# Altium schematic sheet 3 phase NPC inverter.SchDoc
size A2; SheetNumber: 1; SheetTotal: 4
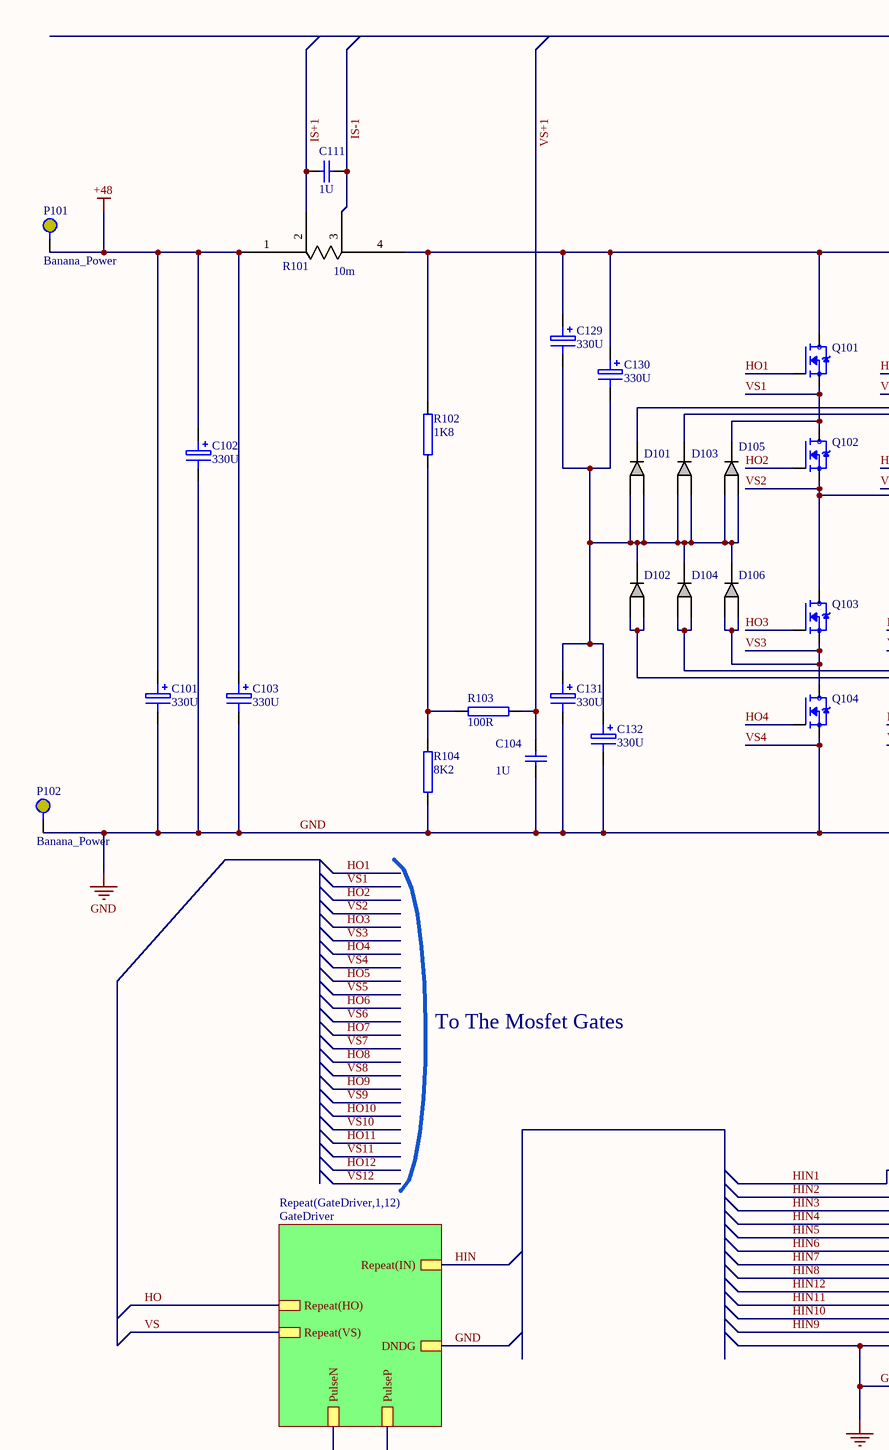
[diagram p0: 3 phase NPC inverter.SchDoc, top left]
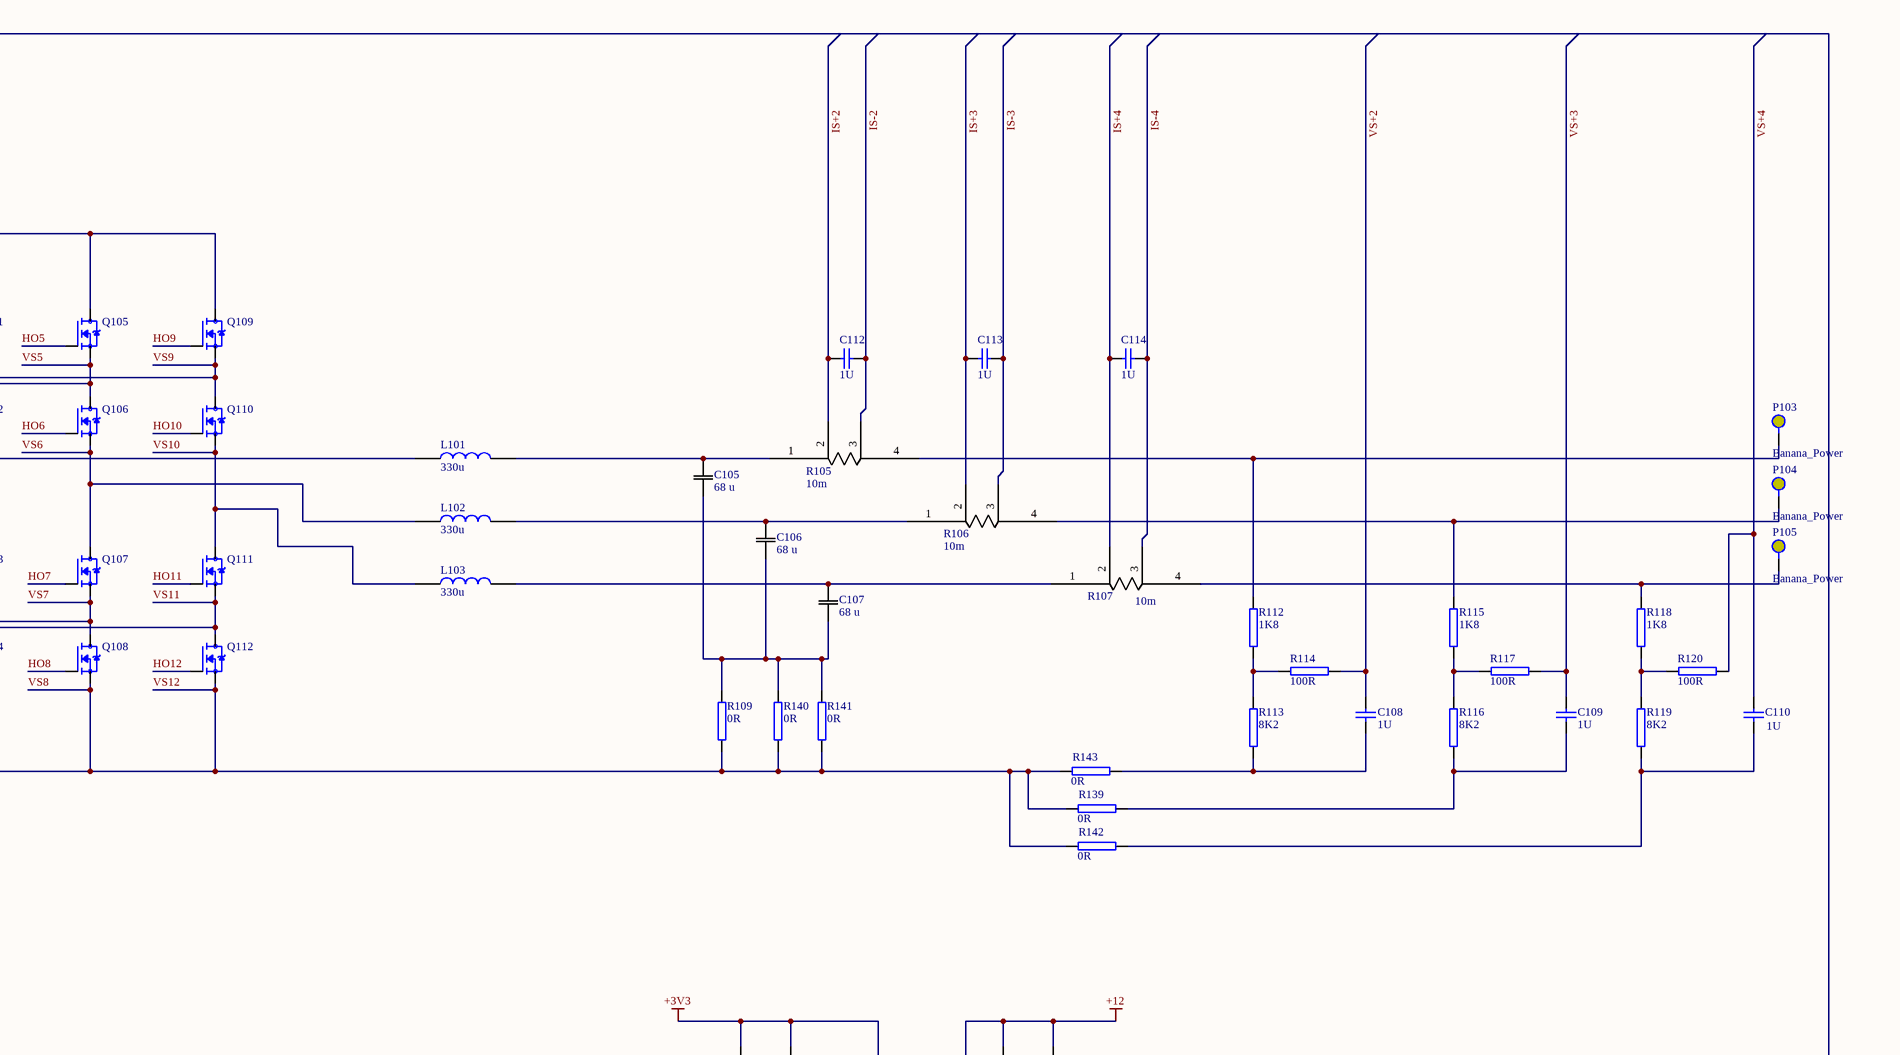
[diagram p1: 3 phase NPC inverter.SchDoc, top right]
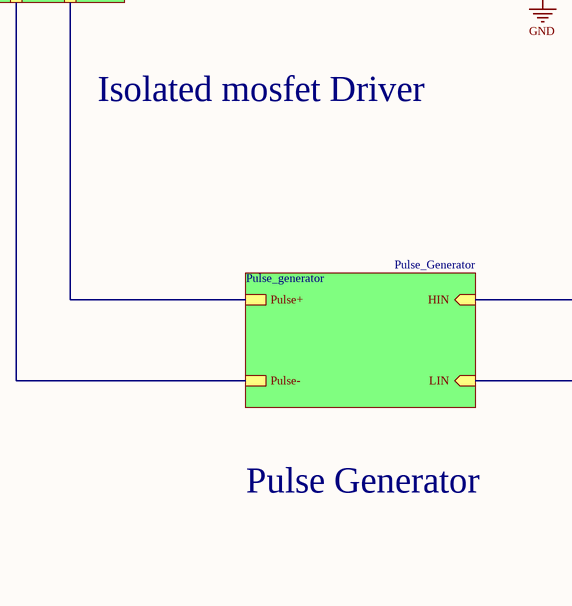
[diagram p2: 3 phase NPC inverter.SchDoc, bottom left]
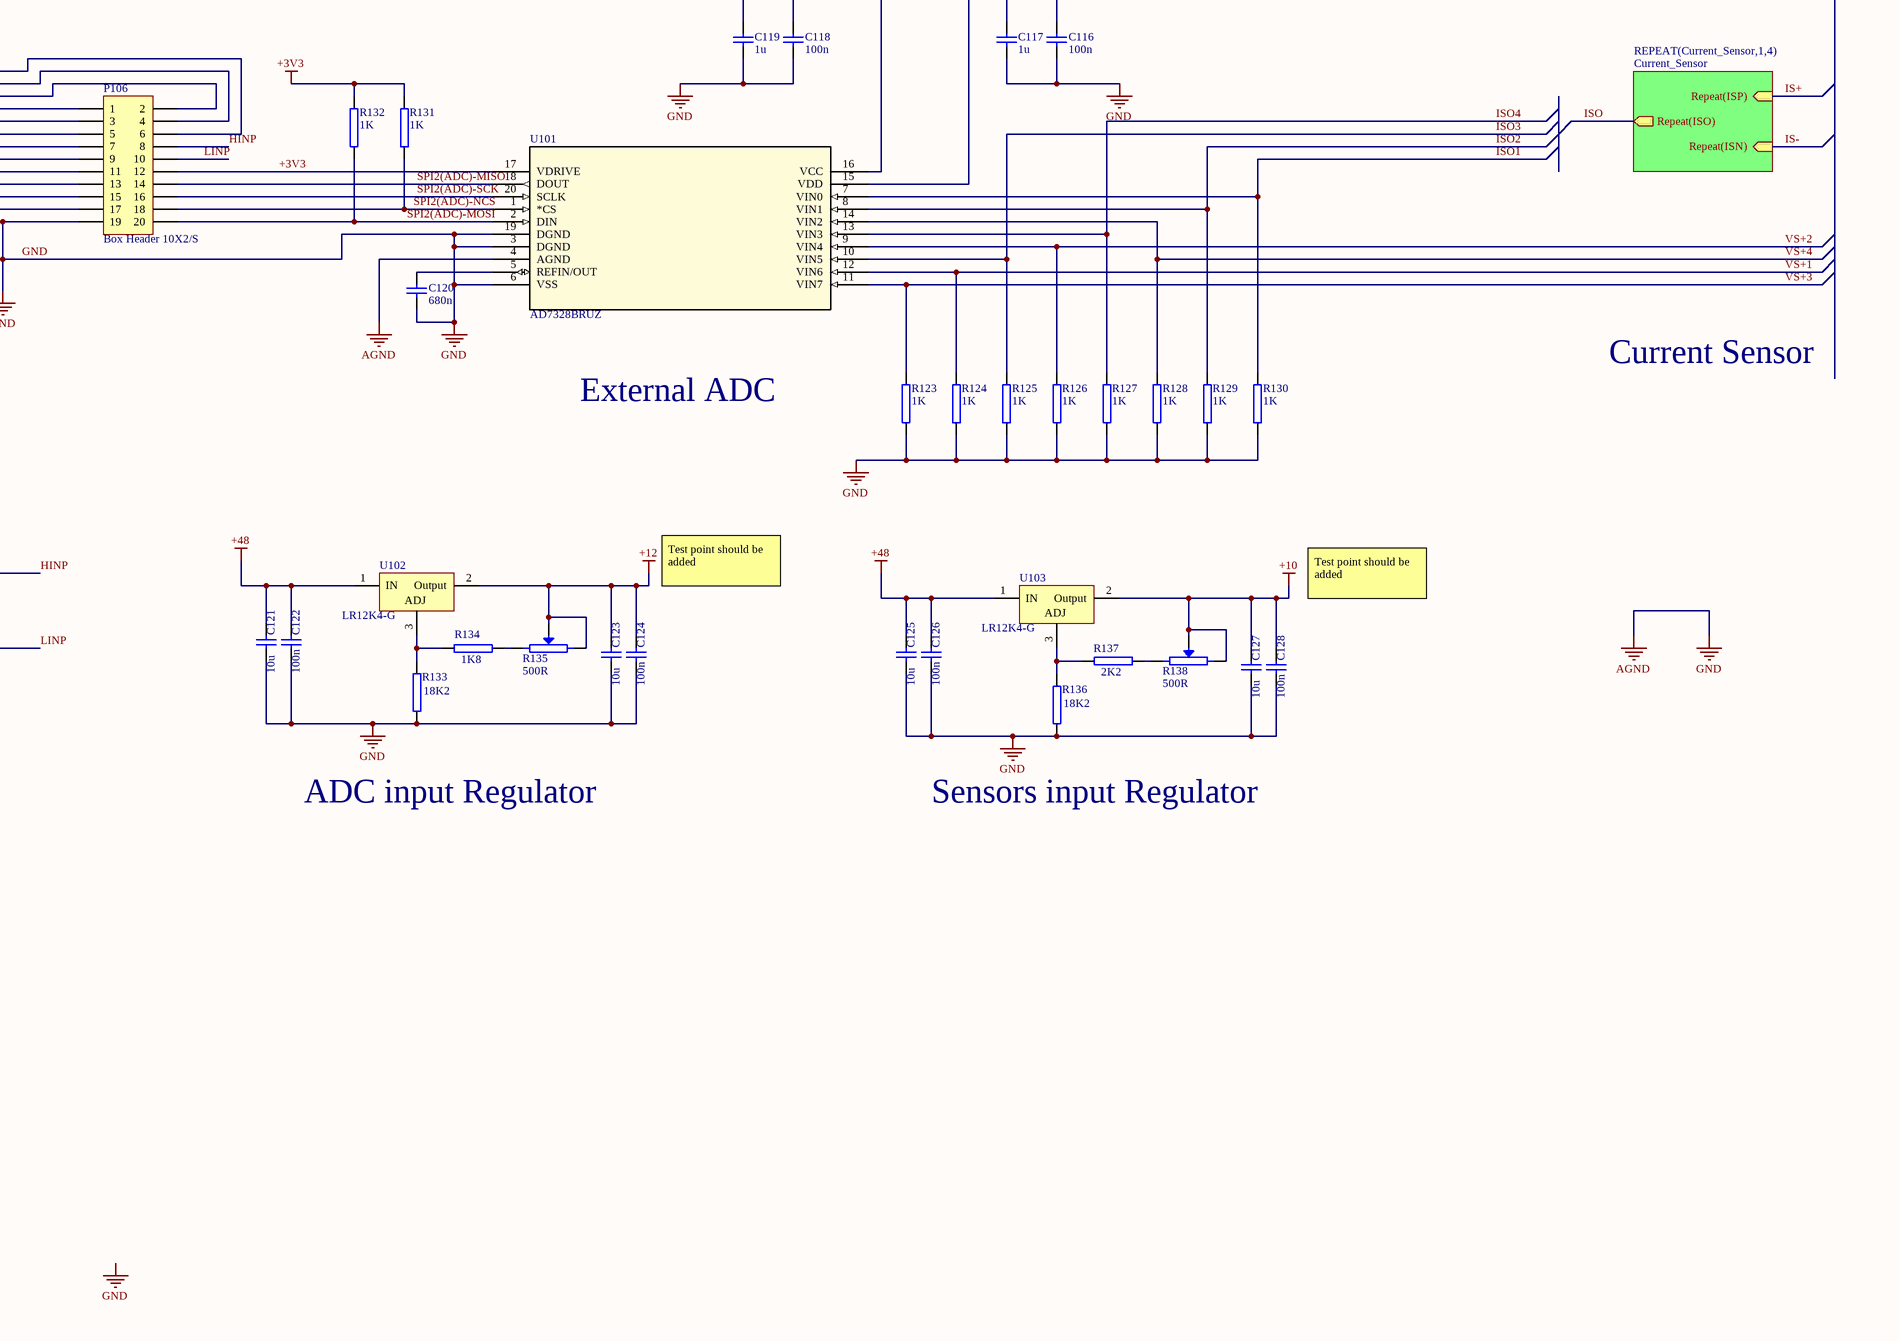
[diagram p3: 3 phase NPC inverter.SchDoc, bottom right]

## Parts
C101  330U  [CAPP300-600_AUT]
C102  330U  [CAPP300-600_AUT]
C103  330U  [CAPP300-600_AUT]
C104  1U  [CAP_1206]
C105  68 u  [B32526R3686K000]
C106  68 u  [B32526R3686K000]
C107  68 u  [B32526R3686K000]
C108  1U  [CAP_1206]
C109  1U  [CAP_1206]
C110  1U  [CAP_1206]
C111  1U  [CAP_1206]
C112  1U  [CAP_1206]
C113  1U  [CAP_1206]
C114  1U  [CAP_1206]
C116  100n  [CAP_1206]
C117  1u  [CAP_1206]
C118  100n  [CAP_1206]
C119  1u  [CAP_1206]
C120  680n  [CAP_1206]
C121  10u  [CAP_1206]
C122  100n  [CAP_1206]
C123  10u  [CAP_1206]
C124  100n  [CAP_1206]
C125  10u  [CAP_1206]
C126  100n  [CAP_1206]
C127  10u  [CAP_1206]
C128  100n  [CAP_1206]
C129  330U  [CAPP300-600_AUT]
C130  330U  [CAPP300-600_AUT]
C131  330U  [CAPP300-600_AUT]
C132  330U  [CAPP300-600_AUT]
D101  FSV20100V  [SOT_20100V_ONS-M]  (value not drawn)
D102  FSV20100V  [SOT_20100V_ONS-M]  (value not drawn)
D103  FSV20100V  [SOT_20100V_ONS-M]  (value not drawn)
D104  FSV20100V  [SOT_20100V_ONS-M]  (value not drawn)
D105  FSV20100V  [SOT_20100V_ONS-M]  (value not drawn)
D106  FSV20100V  [SOT_20100V_ONS-M]  (value not drawn)
L101  330u  [1140-331K-RC]
L102  330u  [1140-331K-RC]
L103  330u  [1140-331K-RC]
P101  Banana_Power  [Banana_Power]
P102  Banana_Power  [Banana_Power]
P103  Banana_Power  [Banana_Power]
P104  Banana_Power  [Banana_Power]
P105  Banana_Power  [Banana_Power]
P106  Box Header 10X2/S  [FKV20SN_AUT]
Q101  MCTL80N20Y-TP  [TOLL-8L]  (value not drawn)
Q102  MCTL80N20Y-TP  [TOLL-8L]  (value not drawn)
Q103  MCTL80N20Y-TP  [TOLL-8L]  (value not drawn)
Q104  MCTL80N20Y-TP  [TOLL-8L]  (value not drawn)
Q105  MCTL80N20Y-TP  [TOLL-8L]  (value not drawn)
Q106  MCTL80N20Y-TP  [TOLL-8L]  (value not drawn)
Q107  MCTL80N20Y-TP  [TOLL-8L]  (value not drawn)
Q108  MCTL80N20Y-TP  [TOLL-8L]  (value not drawn)
Q109  MCTL80N20Y-TP  [TOLL-8L]  (value not drawn)
Q110  MCTL80N20Y-TP  [TOLL-8L]  (value not drawn)
Q111  MCTL80N20Y-TP  [TOLL-8L]  (value not drawn)
Q112  MCTL80N20Y-TP  [TOLL-8L]  (value not drawn)
R101  10m  [WSL3673R_002-01]
R102  1K8  [RES_1206]
R103  100R  [RES_1206]
R104  8K2  [RES_1206]
R105  10m  [WSL3673R_002-01]
R106  10m  [WSL3673R_002-01]
R107  10m  [WSL3673R_002-01]
R109  0R  [RES_1206]
R112  1K8  [RES_1206]
R113  8K2  [RES_1206]
R114  100R  [RES_1206]
R115  1K8  [RES_1206]
R116  8K2  [RES_1206]
R117  100R  [RES_1206]
R118  1K8  [RES_1206]
R119  8K2  [RES_1206]
R120  100R  [RES_1206]
R123  1K  [RES_1206]
R124  1K  [RES_1206]
R125  1K  [RES_1206]
R126  1K  [RES_1206]
R127  1K  [RES_1206]
R128  1K  [RES_1206]
R129  1K  [RES_1206]
R130  1K  [RES_1206]
R131  1K  [RES_1206]
R132  1K  [RES_1206]
R133  18K2  [RES_1206]
R134  1K8  [RES_1206]
R135  500R  [3296W]
R136  18K2  [RES_1206]
R137  2K2  [RES_1206]
R138  500R  [3296W]
R139  0R  [RES_1206]
R140  0R  [RES_1206]
R141  0R  [RES_1206]
R142  0R  [RES_1206]
R143  0R  [RES_1206]
U101  AD7328BRUZ  [TSSOP20_44]
U102  LR12K4-G  [D PAK (TO-252-3)]
U103  LR12K4-G  [D PAK (TO-252-3)]

## Sub-sheets
Pulse_generator = Pulse_Generator: HIN (in), LIN (in), Pulse+, Pulse-
REPEAT(Current_Sensor,1,4) = Current_Sensor: Repeat(ISP) (in), Repeat(ISN) (in), Repeat(ISO) (out)
Repeat(GateDriver,1,12) = GateDriver: PulseN, PulseP, DNDG, Repeat(HO), Repeat(IN), Repeat(VS)

## Nets
+3V3: C118.2 C119.2 P106.12 R131.2 R132.2 U101.16(VCC) U101.17(VDRIVE)
+10: C127.2 C128.2 R138.2(BOT) R138.W(TAP) U103.2(Output)
+12: C116.2 C117.2 C123.2 C124.2 R135.2(BOT) R135.W(TAP) U101.15(VDD) U102.2(Output)
+48: C101.1 C102.1 C103.1 C121.2 C122.2 C125.2 C126.2 P101.1 R101.1 U102.1(IN) U103.1(IN)
GND: C101.2 C102.2 C103.2 C104.1 C116.1 C117.1 C118.1 C119.1 C120.1 C121.1 C122.1 C123.1 C124.1 C125.1 C126.1 C127.1 C128.1 C131.2 C132.2 P102.1 P106.19 Q104.2(S) Q108.2(S) Q112.2(S) R104.1 R109.2 R123.1 R124.1 R125.1 R126.1 R127.1 R128.1 R129.1 R130.1 R133.1 R136.1 R139.1 R140.2 R141.2 R142.1 R143.1 U101.3(DGND) U101.4(AGND) U101.6(VSS) U101.19(DGND) ; sheet Repeat(GateDriver,1,12)/DNDG  [also labelled AGND, VS12, VS4, VS8]
HIN: sheet Repeat(GateDriver,1,12)/Repeat(IN)
HIN1: P106.6
HIN2: P106.4
HIN3: P106.2
HIN4: P106.1
HIN5: P106.3
HIN6: P106.5
HIN7: P106.7
HIN8: P106.9
HIN9: P106.17
HIN10: P106.15
HIN11: P106.13
HIN12: P106.11
HINP: P106.8 ; sheet Pulse_generator/HIN
HO: sheet Repeat(GateDriver,1,12)/Repeat(HO)
HO1: Q101.1(G)
HO2: Q102.1(G)
HO3: Q103.1(G)
HO4: Q104.1(G)
HO5: Q105.1(G)
HO6: Q106.1(G)
HO7: Q107.1(G)
HO8: Q108.1(G)
HO9: Q109.1(G)
HO10: Q110.1(G)
HO11: Q111.1(G)
HO12: Q112.1(G)
IS+: sheet REPEAT(Current_Sensor,1,4)/Repeat(ISP)
IS+1: C111.2 R101.2
IS+2: C112.2 R105.2
IS+3: C113.2 R106.2
IS+4: C114.2 R107.2
IS-: sheet REPEAT(Current_Sensor,1,4)/Repeat(ISN)
IS-1: C111.1 R101.3
IS-2: C112.1 R105.3
IS-3: C113.1 R106.3
IS-4: C114.1 R107.3
ISO: sheet REPEAT(Current_Sensor,1,4)/Repeat(ISO)
ISO1: R130.2 U101.7(VIN0)
ISO2: R129.2 U101.8(VIN1)
ISO3: R125.2 U101.10(VIN5)
ISO4: R127.2 U101.13(VIN3)
LINP: P106.10 ; sheet Pulse_generator/LIN
SPI2(ADC)-MISO: P106.14 U101.18(DOUT)
SPI2(ADC)-MOSI: P106.20 R132.1 U101.2(DIN)
SPI2(ADC)-NCS: P106.18 R131.1 U101.1(*CS)
SPI2(ADC)-SCK: P106.16 U101.20(SCLK)
VS: sheet Repeat(GateDriver,1,12)/Repeat(VS)
VS1: D105.3(C) Q101.2(S) Q102.3(D)
VS2: L101.1 Q102.2(S) Q103.3(D)
VS3: D106.1(A) D106.2(A) Q103.2(S) Q104.3(D)
VS5: D103.3(C) Q105.2(S) Q106.3(D)
VS6: L102.1 Q106.2(S) Q107.3(D)
VS7: D104.1(A) D104.2(A) Q107.2(S) Q108.3(D)
VS9: D101.3(C) Q109.2(S) Q110.3(D)
VS10: L103.1 Q110.2(S) Q111.3(D)
VS11: D102.1(A) D102.2(A) Q111.2(S) Q112.3(D)
VS+1: C104.2 R103.1 R124.2 U101.12(VIN6)
VS+2: C108.2 R114.1 R126.2 U101.9(VIN4)
VS+3: C109.2 R117.1 R123.2 U101.11(VIN7)
VS+4: C110.2 R120.1 R128.2 U101.14(VIN2)
NetC105_1: C105.1 C106.1 C107.1 R109.1 R140.1 R141.1
NetC105_2: C105.2 L101.2 R105.1
NetC106_2: C106.2 L102.2 R106.1
NetC107_2: C107.2 L103.2 R107.1
NetC108_1: C108.1 R113.1 R143.2
NetC109_1: C109.1 R116.1 R139.2
NetC110_1: C110.1 R119.1 R142.2
NetC120_2: C120.2 U101.5(REFIN/OUT)
NetC129_1: C129.1 C130.1 Q101.3(D) Q105.3(D) Q109.3(D) R101.4 R102.2
NetC129_2: C129.2 C130.2 C131.1 C132.1 D101.1(A) D101.2(A) D102.3(C) D103.1(A) D103.2(A) D104.3(C) D105.1(A) D105.2(A) D106.3(C)
NetP103_1: P103.1 R105.4 R112.2
NetP104_1: P104.1 R106.4 R115.2
NetP105_1: P105.1 R107.4 R118.2
NetR102_1: R102.1 R103.2 R104.2
NetR112_1: R112.1 R113.2 R114.2
NetR115_1: R115.1 R116.2 R117.2
NetR118_1: R118.1 R119.2 R120.2
NetR133_2: R133.2 R134.2 U102.3(ADJ)
NetR134_1: R134.1 R135.1(TOP)
NetR136_2: R136.2 R137.2 U103.3(ADJ)
NetR137_1: R137.1 R138.1(TOP)
(unnamed): sheet Repeat(GateDriver,1,12)/PulseN, sheet Pulse_generator/Pulse-
(unnamed): sheet Repeat(GateDriver,1,12)/PulseP, sheet Pulse_generator/Pulse+

## Notes on the sheet
- To The Mosfet Gates
- Isolated mosfet Driver
- External ADC
- Current Sensor
- Test point should be added
- Pulse Generator
- ADC input Regulator
- Sensors input Regulator
- Labels drawn without touching a wire or pin: GND

## Library data of the parts
C101-C103 C129-C132 = CAPP300-600: Polarized Aluminum Capacitor, Through Hole, Pitch 300mil, Body 600mil (Dia)
C104 C108-C114 C116-C128 = CAPN 1206: Non Polarized Capacitor, SMD, 1206
C105-C107 = B32526R3686K000: 68 µF Film Capacitor 160V 250V Polyester, Polyethylene Terephthalate (PET), Metallized Radial / https://www.digikey.co.nz/en/products/detail/epcos-tdk-electronics/B32526R3686K000/3490213; ComponentLink1Description: New link; ComponentLink1URL: https://www.digikey.co.nz/en/products/detail/epcos-tdk-electronics/B32526R3686K000/3490213
D101-D106 = FSV20100V: Diode 100 V 20A Surface Mount TO-277-3 / https://www.digikey.co.nz/en/products/detail/onsemi/FSV20100V/5306665; ComponentLink1Description: New link; ComponentLink1URL: https://www.digikey.co.nz/en/products/detail/onsemi/FSV20100V/5306665
L101-L103 = 1140-331K-RC: Power Inductors - Leaded 330uH 10% / https://nz.mouser.com/ProductDetail/Bourns/1140-331K-RC?qs=wiQ7G1Lt8gwP8A01VI%2FcoA%3D%3D; ComponentLink1Description: New link; ComponentLink1URL: https://nz.mouser.com/ProductDetail/Bourns/1140-331K-RC?qs=wiQ7G1Lt8gwP8A01VI%2FcoA%3D%3D
P101-P105 = Banana_Power: 4mm pitch
P106 = Box Header 10X2/S: Header, Box, 20 Way, 2.54mm, Straght; Supplier 1: Farnell; Supplier Part Number 1: 8395942
Q101-Q112 = MCTL80N20Y-TP: N-Channel 200 V 80A (Tc) 250W (Tj) Surface Mount TOLL-8L
R101 R105-R107 = WSL3673R-01: Current Shunt / Kelvin 4W 0.002- 0.01
R102-R104 R109 R112-R120 R123-R134 R136 R137 R139-R143 = Resistor 1206: Resistor, SMD, 1206
R135 R138 = 3296W-1-104LF: 3296W Series, 3/8 ” Square Potentiometer, 100k, 10%,  0.5 Watts, Multi Turn / Part #: PV36W501C01B00; Supplier 1: Farnell; Supplier Part Number 1: 9353194
U101 = AD7328BRUZ: ADC 12 Bit / Package TSSOP20
U102 U103 = LR12K4-G: Adj Positive Regulator / Linear. 12V dropout V. / 2W